# Altium schematic sheet ROARCAT.SchDoc: =DocumentName
size 420 x 297 mm; CompanyName: "AS Manufacturing" LLC; Organization: "AS Manufacturing" LLC; Address1: 5 Sklyarenka St.; Address2: Kyiv 04073; Address3: Ukraine; Address4: https://ajax.systems/en/; DocumentNumber: 2; SheetNumber: 2; SheetTotal: 6; Template_version: 1.0.1
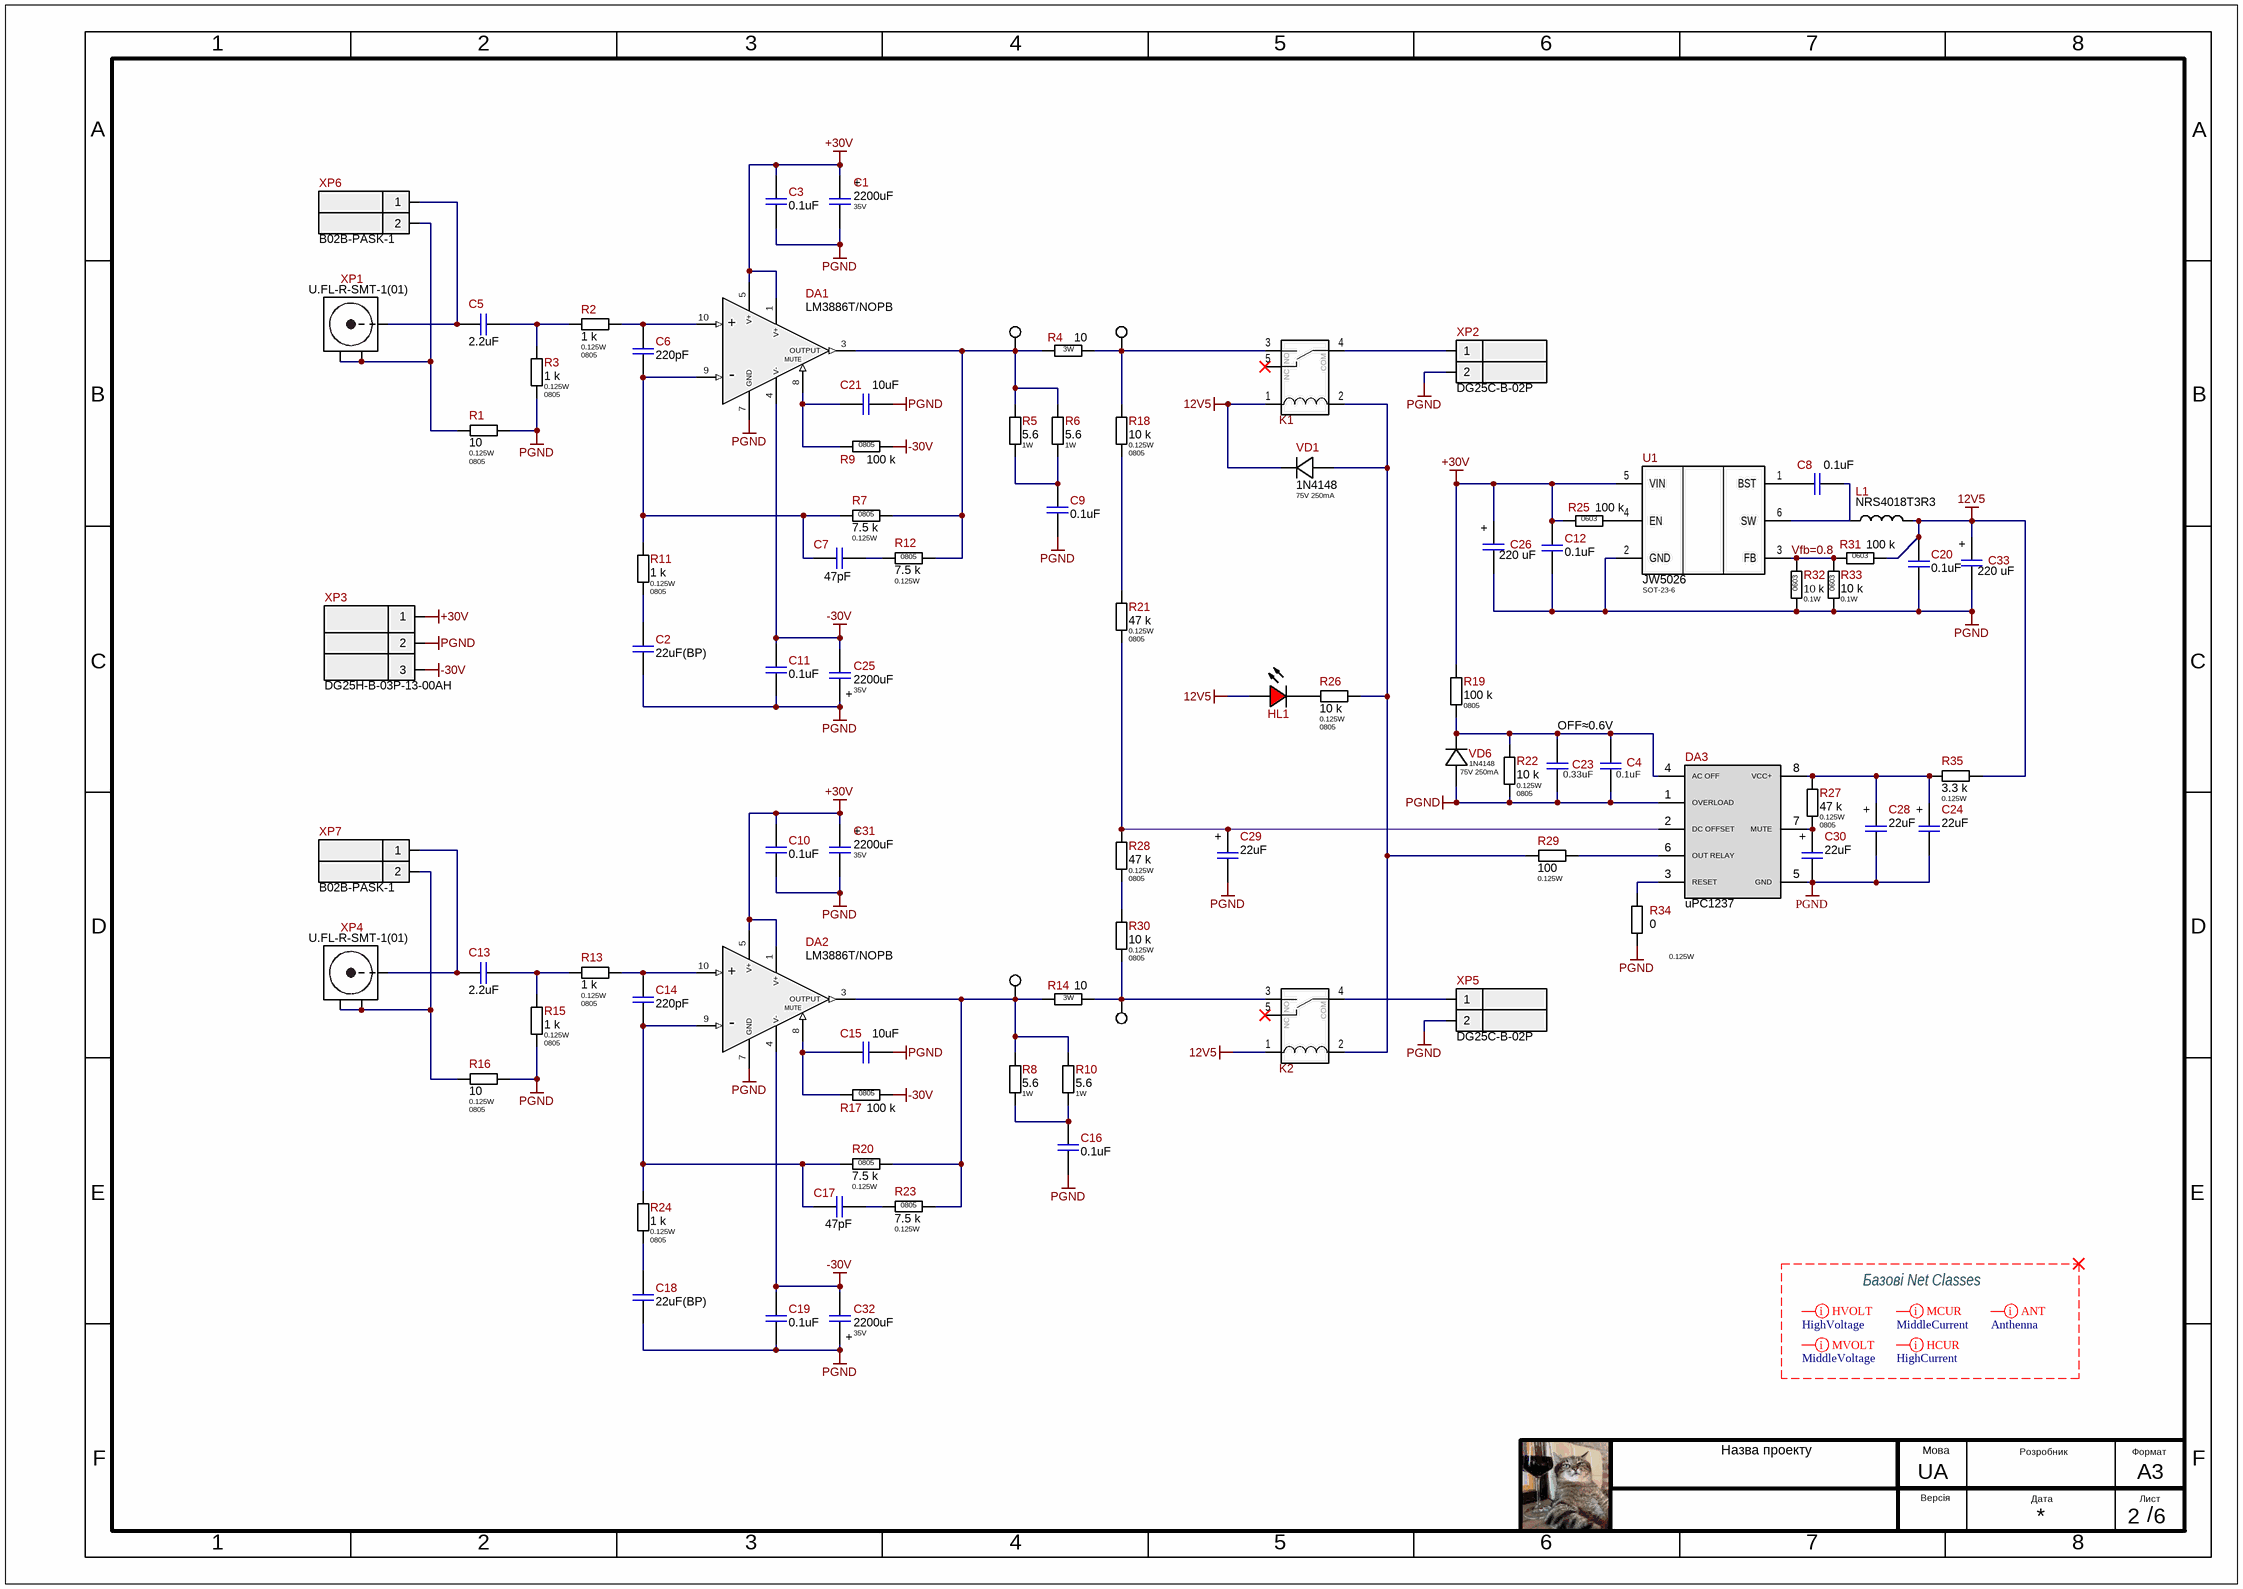
[diagram p0: ROARCAT.SchDoc]

## Parts
C1  2200uF  Power (V/A): 35V  [CAP16x31.5]
C2  22uF(BP)  [CAP-AE-PTH-80D05x115H15]
C3  0.1uF  [C0805(2012)]
C4  0.1uF  [C0805(2012)]
C5  2.2uF  [WIMA5]
C6  220pF  [C0603(1608)]
C7  47pF  [C0603(1608)]
C8  0.1uF  [C0603(1608)]
C9  0.1uF  [CAP 5MM]
C10  0.1uF  [C0805(2012)]
C11  0.1uF  [C0805(2012)]
C12  0.1uF  [C0603(1608)]
C13  2.2uF  [WIMA5]
C14  220pF  [C0603(1608)]
C15  10uF  [C1206(3216)]
C16  0.1uF  [CAP 5MM]
C17  47pF  [C0603(1608)]
C18  22uF(BP)  [CAP-AE-PTH-80D05x115H15]
C19  0.1uF  [C0805(2012)]
C20  0.1uF  [C0603(1608)]
C21  10uF  [C1206(3216)]
C23  0.33uF  [C0805(2012)]
C24  22uF  [CAP-AE-PTH-40D05x70H10]
C25  2200uF  Power (V/A): 35V  [CAP16x31.5]
C26  220 uF  [CAP 8x9]
C28  22uF  [CAP-AE-PTH-40D05x70H10]
C29  22uF  [CAP-AE-PTH-40D05x70H10]
C30  22uF  [CAP-AE-PTH-40D05x70H10]
C31  2200uF  Power (V/A): 35V  [CAP16x31.5]
C32  2200uF  Power (V/A): 35V  [CAP16x31.5]
C33  220 uF  [CAP 8x9]
DA1  LM3886T/NOPB  [TO-220-11]
DA2  LM3886T/NOPB  [TO-220-11]
DA3  uPC1237  [SIP-8]
HL1  FYLS-0603BURC  [LED-0603R]  (value not drawn)
K1  LEG-12  [Relay10A]  (value not drawn)
K2  LEG-12  [Relay10A]  (value not drawn)
L1  NRS4018T3R3  [WE-LQS SMD 4018]
R1  10  Power Rating: 0.125W  Package/Case: 0805  [R0805]
R2  1 k  Power Rating: 0.125W  Package/Case: 0805  [R0805]
R3  1 k  Power Rating: 0.125W  Package/Case: 0805  [R0805]
R4  10  Power Rating: 3W  [R3W]
R5  5.6  Power Rating: 1W  [R2512]
R6  5.6  Power Rating: 1W  [R2512]  (mechanical)
R7  7.5 k  Power Rating: 0.125W  Package/Case: 0805  [R0805]
R8  5.6  Power Rating: 1W  [R2512]
R9  100 k  Package/Case: 0805  [R0805]
R10  5.6  Power Rating: 1W  [R2512]  (mechanical)
R11  1 k  Power Rating: 0.125W  Package/Case: 0805  [R0805]
R12  7.5 k  Power Rating: 0.125W  Package/Case: 0805  [R0805]
R13  1 k  Power Rating: 0.125W  Package/Case: 0805  [R0805]
R14  10  Power Rating: 3W  [R3W]
R15  1 k  Power Rating: 0.125W  Package/Case: 0805  [R0805]
R16  10  Power Rating: 0.125W  Package/Case: 0805  [R0805]
R17  100 k  Package/Case: 0805  [R0805]
R18  10 k  Power Rating: 0.125W  Package/Case: 0805  [R0805]
R19  100 k  Package/Case: 0805  [R0805]
R20  7.5 k  Power Rating: 0.125W  Package/Case: 0805  [R0805]
R21  47 k  Power Rating: 0.125W  Package/Case: 0805  [R0805]
R22  10 k  Power Rating: 0.125W  Package/Case: 0805  [R0805]
R23  7.5 k  Power Rating: 0.125W  Package/Case: 0805  [R0805]
R24  1 k  Power Rating: 0.125W  Package/Case: 0805  [R0805]
R25  100 k  Package/Case: 0603  [R0603]
R26  10 k  Power Rating: 0.125W  Package/Case: 0805  [R0805]
R27  47 k  Power Rating: 0.125W  Package/Case: 0805  [R0805]
R28  47 k  Power Rating: 0.125W  Package/Case: 0805  [R0805]
R29  100  Power Rating: 0.125W  [R0805]
R30  10 k  Power Rating: 0.125W  Package/Case: 0805  [R0805]
R31  100 k  Package/Case: 0603  [R0603]
R32  10 k  Power Rating: 0.1W  Package/Case: 0603  [R0603]
R33  10 k  Power Rating: 0.1W  Package/Case: 0603  [R0603]  (mechanical)
R34  0  Power Rating: 0.125W  [R0805]
R35  3.3 k  Power Rating: 0.125W  [R0805]
TP1  PAD-1.75mm  [PAD-1.75mm]  (value not drawn)  (no BOM)
TP2  PAD-1.75mm  [PAD-1.75mm]  (value not drawn)  (no BOM)
TP3  PAD-1.75mm  [PAD-1.75mm]  (value not drawn)  (no BOM)
TP4  PAD-1.75mm  [PAD-1.75mm]  (value not drawn)  (no BOM)
U1  JW5026  Package: SOT-23-6  [SOT23-6]
VD1  1N4148  Power Rating: 75V 250mA  [SOD-80]
VD6  1N4148  Power Rating: 75V 250mA  [SOD-80]
XP1  U.FL-R-SMT-1(01)  [IPEX_ RECE.20279.001E.01]
XP2  DG25C-B-02P  [DG25C-B-02P]
XP3  DG25H-B-03P-13-00AH  [DG25H-B-03P]
XP4  U.FL-R-SMT-1(01)  [IPEX_ RECE.20279.001E.01]
XP5  DG25C-B-02P  [DG25C-B-02P]
XP6  B02B-PASK-1  [JST_B02B-PASK-1(LF)(SN)]
XP7  B02B-PASK-1  [JST_B02B-PASK-1(LF)(SN)]

## Nets
12V5: C20.2 C33.1 HL1.1(A) K1.1 K2.1 L1.2 R31.2 R35.1 VD1.1(K)
+30V: C1.1 C3.1 C10.1 C12.2 C26.1 C31.1 DA1.1(V+) DA1.5(V+) DA2.1(V+) DA2.5(V+) R19.2 R25.1 U1.5(VIN) XP3.1
-30V: C11.2 C19.2 C25.2 C32.2 DA1.4(V-) DA2.4(V-) R9.2 R17.2 XP3.3
PGND: C1.2 C2.1 C3.2 C4.1 C9.2 C10.2 C11.1 C12.1 C15.2 C16.2 C18.1 C19.1 C20.1 C21.2 C23.1 C24.2 C25.1 C26.2 C28.2 C29.2 C30.2 C31.2 C32.1 C33.2 DA1.7(GND) DA2.7(GND) DA3.1(OVERLOAD) DA3.5(GND) R1.2 R3.2 R15.2 R16.2 R22.1 R32.1 R33.1 R34.1 U1.2(GND) VD6.2(A) XP2.2 XP3.2 XP5.2
OFF≈0.6V: C4.2 C23.2 DA3.4(AC_OFF) R19.1 R22.2 VD6.1(K)
Vfb=0.8: R31.1 R32.2 R33.2 U1.3(FB)
NetC2_2: C2.2 R11.1
NetC5_1: C5.1 XP1.1 XP6.1
NetC5_2: C5.2 R2.2 R3.1
NetC6_1: C6.1 C7.1 DA1.9(VIN-) R7.1 R11.2
NetC6_2: C6.2 DA1.10(VIN+) R2.1
NetC7_2: C7.2 R12.1
NetC8_1: C8.1 U1.1(BST)
NetC8_2: C8.2 L1.1 U1.6(SW)
NetC9_1: C9.1 R5.1 R6.1
NetC13_1: C13.1 XP4.1 XP7.1
NetC13_2: C13.2 R13.2 R15.1
NetC14_1: C14.1 C17.1 DA2.9(VIN-) R20.1 R24.2
NetC14_2: C14.2 DA2.10(VIN+) R13.1
NetC15_1: C15.1 DA2.8(MUTE) R17.1
NetC16_1: C16.1 R8.1 R10.1
NetC17_2: C17.2 R23.1
NetC18_2: C18.2 R24.1
NetC21_1: C21.1 DA1.8(MUTE) R9.1
NetC24_1: C24.1 C28.1 DA3.8(VCC+) R27.2 R35.2
NetC29_1: C29.1 DA3.2(DC_OFFSET) R21.1 R28.2
NetC30_1: C30.1 DA3.7(MUTE) R27.1
NetDA1_3: DA1.3(OUTPUT) R4.1 R5.2 R6.2 R7.2 R12.2 TP2.1
NetDA2_3: DA2.3(OUTPUT) R8.2 R10.2 R14.1 R20.2 R23.2 TP3.1
NetDA3_3: DA3.3(RESET) R34.2
NetDA3_6: DA3.6(OUT_RELAY) R29.1
NetHL1_2: HL1.2(K) R26.2
NetK1_2: K1.2 K2.2 R26.1 R29.2 VD1.2(A)
NetK1_3: K1.3(NO) R4.2 R18.2 TP1.1
NetK1_4: K1.4(COM) XP2.1
NetK2_3: K2.3(NO) R14.2 R30.1 TP4.1
NetK2_4: K2.4(COM) XP5.1
NetR1_1: R1.1 XP1.2 XP1.3 XP6.2
NetR16_1: R16.1 XP4.2 XP4.3 XP7.2
NetR18_1: R18.1 R21.2
NetR25_2: R25.2 U1.4(EN)
NetR28_1: R28.1 R30.2

Not connected (* = marked no-connect by the designer): K1 5(NC)*; K2 5(NC)*

## Layout directives
net class HighVoltage: (no net found under the mark)
net class Anthenna: (no net found under the mark)
net class MiddleVoltage: (no net found under the mark)
net class MiddleCurrent: (no net found under the mark)
net class HighCurrent: (no net found under the mark)

## Notes on the sheet
- Базові Net Classes
- 1
- 2
- 3
- 4
- 5
- 6
- 7
- 8
- A
- B
- C
- D
- E
- F
- Назва проекту
- Мова
- UA
- Розробник
- Формат
- A3
- Версія
- Дата
- Лист
- /
- (in symbol 22uF  25V 4х6) +
- (in symbol 220 uF  16V 8 x 9) +
- (in symbol 2200uF  35V 16x31.5) +
- (in symbol LM3886T/NOPB) +; -

## Library data of the parts
C1 C25 C31 C32 = 2200uF  35V 16x31.5: 2200uF CAP ALUM 22UF 20% 35V RADIAL; Name Component: Electrolytic capacitor; Tolerance: ±10%; Operation Temperature: -55°C ~ 125°C; Library Path 1: Capacitors.SchLib; Part Number: 2200uF  35V 16x31.5; Value: 2200uF; Package/Case: 16x31.5; ComponentLink1Description: Datasheet
C2 C18 = 22uF(BP)  50V  8 x 11.5: ECEA1HN220U 22UF 20% 50V RADIAL; Manufacturer: Panasonic Electronic Components; Name Component: Bipolar Electrolytic Capacitor; Operation Temperature: -55°C ~ 105°C; Library Path 1: Capacitors.SchLib; Part Number: 22uF(BP)  50V  8 x 11.5; Value: 22uF(BP); Tolerance: ±20%; Temperature Coefficient: -; Power (V/A): 50V; Package/Case: 8 x 11.5; Manufacturer P/N: ECEA1HN220U; Supplier 1: kosmodrom; Supplier Part Number 1: P10340-ND; ComponentLink1Description: Datasheet
C3 C4 C10 C11 C19 = 0.1uF  50V C0805: CAP CER 0.1UF 50V X7R 0805; Manufacturer: AVX Corporation; Manufacturer P/N: 08055C104KAT2A; Name Component: Capacitor Ceramic; Tolerance: ±10%; Operation Temperature: -55°C ~ 105°C; Notes: 08055C104KAT4A,08055C104KAJ2A, 08055C104KAJ4A; Library Path 1: Capacitors.SchLib; Part Number: 0.1uF  50V C0805; Value: 0.1uF; Temperature Coefficient: X7R; Power (V/A): 50V; Package/Case: C0805; Supplier 1: Digi-key; Supplier Part Number 1: 478-1395-2-ND; ComponentLink1Description: Datasheet; ComponentLink1URL: http://catalogs.avx.com/SurfaceMount.pdf
C5 C13 = MKS2-2.2U/50-R: CAP FILM 2.2UF 10% 100VDC; Manufacturer: WIMA; Manufacturer P/N: MKS2B042201F00; Name Component: Polypropylene (PP), Metallized; Operation Temperature: -55°C ~ 125°C; Power (V/A): 63В AC, 100В DC; Library Path 1: Capacitors.SchLib; Part Number: MKS2-2.2U/50-R; Value: 2.2uF; Tolerance: ±10%; Package/Case: 5x10x7, 2мм; Supplier 1: kosmodrom; ComponentLink1Description: Datasheet; ComponentLink1URL: https://www.mouser.com/datasheet/2/440/e_WIMA_MKS_2-1139871.pdf?utm_source=chatgpt.com
C6 C14 = 220pF  25V C0603: CAP CER 220PF 25V X7R 0603; Manufacturer: AVX Corporation; Manufacturer P/N: 06033C221MAT2A; Tolerance: ±20%; Name Component: Capacitor Ceramic; Operation Temperature: -55°C ~ 105°C; Notes: 06033C221MAT4A; Library Path 1: Capacitors.SchLib; Part Number: 220pF  25V C0603; Value: 220pF; Supplier 1: Digi-key; Supplier Part Number 1: 06033C221MAT2A-ND; ComponentLink1Description: Datasheet; ComponentLink1URL: http://catalogs.avx.com/SurfaceMount.pdf; Temperature Coefficient: X7R; Power (V/A): 25V; Package/Case: C0603
C7 C17 = 47pF  50V C0603: CAP CER 47PF 50V X7R 0603; Manufacturer: AVX Corporation; Manufacturer P/N: 06035C470KAT2A; Tolerance: ±10%; Name Component: Capacitor Ceramic; Operation Temperature: -55°C ~ 105°C; Library Path 1: Capacitors.SchLib; Part Number: 47pF  50V C0603; Value: 47pF; Supplier 1: Digi-key; Supplier Part Number 1: 06035C470KAT2A-ND; ComponentLink1Description: Datasheet; ComponentLink1URL: http://catalogs.avx.com/SurfaceMount.pdf; Temperature Coefficient: X7R; Power (V/A): 50V; Package/Case: C0603
C8 C12 C20 = 0.1uF  50V C0603: CAP CER 0.1UF 50V X7R 0603; Manufacturer: Samsung Electro-Mechanics; Manufacturer P/N: CL10B104KB8WPNC; Name Component: Capacitor Ceramic; Tolerance: ±10%; Operation Temperature: -55°C ~ 125°C; Notes: 06035C104K4T4A, 06035C104K4T2A; Library Path 1: Capacitors.SchLib; Part Number: 0.1uF  50V C0603; Value: 0.1uF; Temperature Coefficient: X7R; Power (V/A): 50V; Package/Case: C0603; Supplier 1: Digi-key; Supplier Part Number 1: 1276-6854-2-ND; ComponentLink1Description: Datasheet; ComponentLink1URL: https://www.samsungsem.com/resources/file/global/support/product_catalog/MLCC.pdf
C9 C16 = 0.1uF  50V C0805: CAP CER 0.1UF 50V X7R 0805; Manufacturer: AVX Corporation; Manufacturer P/N: 08055C104KAT2A; Tolerance: ±10%; Name Component: Capacitor Ceramic; Operation Temperature: -55°C ~ 105°C; Notes: 08055C104KAT4A,08055C104KAJ2A, 08055C104KAJ4A; Library Path 1: Capacitors.SchLib; Part Number: 0.1uF  50V C0805; Value: 0.1uF; Supplier 1: Digi-key; Supplier Part Number 1: 478-1395-2-ND; ComponentLink1Description: Datasheet; ComponentLink1URL: http://catalogs.avx.com/SurfaceMount.pdf; Temperature Coefficient: X7R; Power (V/A): 50V; Package/Case: C0805
C15 C21 = 10uF  35V С1206: CAP CER 10UF 35V X5R 1206; Manufacturer: AVX Corporation; Manufacturer P/N: 1206DD106KAT2A; Name Component: Capacitor Ceramic; Tolerance: ±10%; Operation Temperature: -55°C ~ 105°C; Library Path 1: Capacitors.SchLib; Part Number: 10uF  35V С1206; Value: 10uF; Temperature Coefficient: X5R; Power (V/A): 35V; Package/Case: С1206; Supplier 1: Digi-key; Supplier Part Number 1: 478-9953-2-ND; ComponentLink1Description: Datasheet; ComponentLink1URL: http://catalogs.avx.com/SurfaceMount.pdf
C23 = 0.33uF  25V C0805: CAP CER 0.33UF 25V X7R 0805; Manufacturer: AVX Corporation; Manufacturer P/N: 08053C334MAT2A; Tolerance: ±20%; Name Component: Capacitor Ceramic; Operation Temperature: -55°C ~ 105°C; Library Path 1: Capacitors.SchLib; Part Number: 0.33uF  25V C0805; Value: 0.33uF; Supplier 1: Digi-key; Supplier Part Number 1: 478-5720-2-ND; ComponentLink1Description: Datasheet; ComponentLink1URL: http://catalogs.avx.com/SurfaceMount.pdf; Temperature Coefficient: X7R; Power (V/A): 25V; Package/Case: C0805
C24 C28-C30 = 22uF  25V 4х6: CAP ALUM 22UF 20% 25V RADIAL; Name Component: Electrolytic capacitor; Tolerance: ±10%; Operation Temperature: -55°C ~ 125°C; Library Path 1: Capacitors.SchLib; Part Number: 22uF  25V 4х6; Value: 22uF; Power (V/A): 25V; Package/Case: 4х6; ComponentLink1Description: Datasheet
C26 C33 = 220 uF  16V 8 x 9: CAP POLY 220 UF 20% 16V 8x9; Manufacturer: Leaguer; Manufacturer P/N: VPT1C221M0809; Name Component: Conductive Polymer Aluminum Solid Capacitors; Operation Temperature: -55°C ~ 105°C; Library Path 1: Capacitors.SchLib; Part Number: 220 uF  16V 8 x 9; Value: 220 uF; Tolerance: ±20%; Temperature Coefficient: -; Power (V/A): 16V; Package/Case: 8 x 9; Supplier 1: RCS; Supplier Part Number 1: 124733; ComponentLink1Description: Datasheet; ComponentLink1URL: https://www.rcscomponents.kiev.ua/datasheets/kks4700608x9-datasheet.pdf
DA1 DA2 = LM3886T/NOPB: IC AMP CLSS AB MONO 68W TO220-11; Manufacturer: Texas Instruments; Name Component: Amplifier; Operation Temperature: -20°C ~ 85°C (TA); Power (V/A): 20V ~ 84V, ±10V ~ 42V; Library Path 1: Integrated Circuit.SchLib; Part Number: LM3886T/NOPB; Value: LM3886T/NOPB; Package/Case: TO-220-11; Manufacturer P/N: LM3886T/NOPB; Supplier 1: Digi-key; Supplier Part Number 1: LM3886T/NOPB-ND; ComponentLink1Description: Datasheet; ComponentLink1URL: https://www.ti.com/general/docs/suppproductinfo.tsp?distId=10&gotoUrl=https%3A%2F%2Fwww.ti.com%2Flit%2Fgpn%2Flm3886
DA3 = uPC1237: Protector IC for Stereo Power Amplifier & Loudspeaker, 25-60V, -20-75°C; Manufacturer: NEC; Name Component: Audio Protect; Operation Temperature: -20°C ~ 75°C; Power (V/A): 12-15V; Library Path 1: Integrated Circuit.SchLib; Part Number: uPC1237; Value: uPC1237; Package/Case: SIP-8; ComponentLink1Description: Datasheet; ComponentLink1URL: https://www.rcscomponents.kiev.ua/datasheets/datasheet_upc1237.pdf
HL1 = FYLS-0603BURC: LED RED LED0603; Manufacturer: FORYARD; Name Component: LED Lighting; Operation Temperature: -40 ~ +85; Power (V/A): 20mA; Library Path 1: Optoelectronic.SchLib; Part Number: FYLS-0603BURC; Value: FYLS-0603BURC; Package/Case: 0603; Manufacturer P/N: FYLS-0603BURC; Notes: Red; ComponentLink1Description: Datasheet; ComponentLink1URL: http://www.foryard-led.ru/pdf/fyls-0603burc.pdf
K1 K2 = LEG-12: General Purpose Relay, 1 Form C (1PDT), 12VDC 400Ohm Coil, 120VAC/24VDC @ 10A, 240VAC Max; Operation Temperature: -55°C ~ 125°C (TA); Power (V/A): 12V; Library Path 1: Others.SchLib; ComponentLink1URL: https://www.tme.eu/Document/311affc211749c2a4c93ad074af62b72/LEG-SERIES.pdf; ComponentLink1Description: Datasheet; Part Number: LEG-12; Name Component: Relay; Value: LEG-12; Supplier Part Number 1: Relay10A
L1 = NRS4018T3R3: FIXED IND 3.3UH 2A 66 MOHM SMD; Manufacturer: TaiyoYuden; Manufacturer P/N: NRS4018T3R3MDGJ; Name Component: Fixed Inductors; Tolerance: ±20; Operation Temperature: -25°C ~ 120°C; Library Path 1: Inductance.SchLib; Part Number: NRS4018T3R3; Value: NRS4018T3R3; Power (V/A): 2A; Package/Case: 4.00mm x 4.00mm; Supplier 1: Digi-key; Supplier Part Number 1: 587-2892-2-ND; ComponentLink1Description: Datasheet; ComponentLink1URL: https://www.yuden.co.jp/productdata/catalog/wound04_e.pdf
R1 R16 = 10  R0805: RES SMD 10 OHM  ±1% 1/8W 0805; Name Component: Resistror; Operation Temperature: -55℃ to 155℃; Temperature Coefficient: ±200 ppm/°C; Library Path 1: Resistor.SchLib; Part Number: 10  R0805; Value: 10; Tolerance: ±1%
R2 R3 R11 R13 R15 R24 = 1 k  R0805: RES SMD 1 k OHM  ±1% 1/8W 0805; Name Component: Resistror; Operation Temperature: -55℃ to 155℃; Temperature Coefficient: ±100 ppm/°C; Library Path 1: Resistor.SchLib; Part Number: 1 k  R0805; Value: 1 k; Tolerance: ±1%
R4 R14 = 10  RES_3W: Resistror 10 OHM  ±5% AXIAL  5.50mm x 15.00mm; Operation Temperature: -55℃ to 155℃; Temperature Coefficient: ±200 ppm/°C; Library Path 1: Resistor.SchLib; Part Number: 10  RES_3W; Name Component: Resistror; Value: 10; Tolerance: ±5%
R5 R6 R8 R10 = 5.6  R2512: Resistror 5.6 OHM  ±5% 2512 1W; Operation Temperature: -55℃ to 155℃; Temperature Coefficient: ±200 ppm/°C; Library Path 1: Resistor.SchLib; Part Number: 5.6  R2512; Name Component: Resistror; Value: 5.6; Tolerance: ±5%
R7 R12 R20 R23 = 7.5 k  R0805: RES SMD 7.5 k OHM  ±1% 1/8W 0805; Name Component: Resistror; Operation Temperature: -55℃ to 155℃; Temperature Coefficient: ±100 ppm/°C; Library Path 1: Resistor.SchLib; Part Number: 7.5 k  R0805; Value: 7.5 k; Tolerance: ±1%
R9 R17 = 10 k  R0805: RES SMD 10 k OHM  ±1% 1/8W 0805; Power Rating: 0.125W; Name Component: Resistror; Operation Temperature: -55℃ to 155℃; Temperature Coefficient: ±100 ppm/°C; Library Path 1: Resistor.SchLib; Part Number: 10 k  R0805; Value: 100 k; Tolerance: ±1%
R18 R22 R26 R30 = 10 k  R0805: RES SMD 10 k OHM  ±1% 1/8W 0805; Name Component: Resistror; Operation Temperature: -55℃ to 155℃; Temperature Coefficient: ±100 ppm/°C; Library Path 1: Resistor.SchLib; Part Number: 10 k  R0805; Value: 10 k; Tolerance: ±1%
R19 = 100 k  R0805: RES SMD 100 k OHM  ±1% 1/8W 0805; Power Rating: 0.125W; Name Component: Resistror; Operation Temperature: -55℃ to 155℃; Temperature Coefficient: ±100 ppm/°C; Library Path 1: Resistor.SchLib; Part Number: 100 k  R0805; Value: 100 k; Tolerance: ±1%
R21 R27 R28 = 47 k  R0805: RES SMD 47 k OHM  ±1% 1/8W 0805; Name Component: Resistror; Operation Temperature: -55℃ to 155℃; Temperature Coefficient: ±100 ppm/°C; Library Path 1: Resistor.SchLib; Part Number: 47 k  R0805; Value: 47 k; Tolerance: ±1%
R25 R31 = 100 k  R0603: RES SMD 100 k OHM  ±1% 1/10W 0603; Power Rating: 0.1W; Name Component: Resistror; Operation Temperature: -55℃ to 155℃; Temperature Coefficient: ±100 ppm/°C; Library Path 1: Resistor.SchLib; Part Number: 100 k  R0603; Value: 100 k; Tolerance: ±1%
R29 = 100  R0805: RES SMD 100 OHM  ±1% 1/8W 0805; Name Component: Resistror; Operation Temperature: -55℃ to 155℃; Temperature Coefficient: ±100 ppm/°C; Library Path 1: Resistor.SchLib; Package/Case: 0805; Part Number: 100  R0805; Value: 100; Tolerance: ±1%
R32 R33 = 10 k  R0603: RES SMD 10 k OHM  ±1% 1/10W 0603; Name Component: Resistror; Operation Temperature: -55℃ to 155℃; Temperature Coefficient: ±100 ppm/°C; Library Path 1: Resistor.SchLib; Part Number: 10 k  R0603; Value: 10 k; Tolerance: ±1%
R34 = 0  R0805: RES SMD 0 OHM  ±1% 1/8W 0805; Part Number: 0  R0805; Name Component: Resistror; Operation Temperature: -55℃ to 155℃; Temperature Coefficient: ±200 ppm/°C; Library Path 1: Resistor.SchLib; Value: 0; Tolerance: ±1%; Package/Case: 0805
R35 = 3.3 k  R0805: RES SMD 3.3 k OHM  ±1% 1/8W 0805; Name Component: Resistror; Operation Temperature: -55℃ to 155℃; Temperature Coefficient: ±100 ppm/°C; Library Path 1: Resistor.SchLib; Part Number: 3.3 k  R0805; Value: 3.3 k; Tolerance: ±1%; Package/Case: 0805
TP1-TP4 = PAD-1.75mm: 1.75mm Pad for Plug-In or Receptacle; Ajax_1C_PN: NONE; Ajax_1С_Status: RND Only; Component Status: Released; Part Number: PAD-1.75mm; Component Type: PTH; Manufacturer: NONE; Part Type: Pad; Temperature Range: NONE; ComponentLink1URL: NONE; Replacement: NONE; Price: NONE; ComponentLink1Description: Datasheet
U1 = JW5026: Switching Voltage Regulators 4.7V to 40V Input, 1A Output , Vfb = 0.6V VStep-Down Converter SOT-23-6; Manufacturer: Joulwatt Technology; Name Component: Power converters; Operation Temperature: -40°C ~ 125°C (TJ); Power (V/A): 4.7…40V 2A; Library Path 1: Power converters.SchLib; ComponentDescription: Power converters JW5026  (SOT 23-6); ComponentLink1URL: https://www.skytech.ir/DownLoad/File/2588_JW5026.pdf; ComponentLink1Description: Datasheet; Part Number: JW5026; Value: JW5026; Package/Case: SOT 23-6; Supplier 1: Kosmodrom; Supplier Part Number 1: JW5026
VD1 VD6 = 1N4148: DIODE GEN PURP 75V 250MA SOD323; Manufacturer: Diodes Incorporated; Operation Temperature: -55°C ~ 150°C; Library Path 1: Diodes.SchLib; Part Number: 1N4148; Name Component: Diode; Value: 1N4148; Package/Case: SOD-80; Manufacturer P/N: 1N4148; Supplier 1: Digi-key; Supplier Part Number 1: 1N4148; ComponentLink1Description: Datasheet
XP1 XP4 = U.FL-R-SMT-1(01): CONN UMC RCPT STR 50 OHM SMD; Manufacturer: HIROSE; Name Component: U.FL (IPX/AMC); Operation Temperature: -10°C …. 40°C; Library Path 1: Connectors.SchLib; System: Connector; Part Number: U.FL-R-SMT-1(01); Value: U.FL-R-SMT-1(01); Package/Case: Male Pin; Manufacturer P/N: U.FL-R-SMT-1(01); Supplier 1: TME; ComponentLink1Description: Datasheet; ComponentLink1URL: https://www.tme.eu/ua/ru/details/u.fl-r-smt-1-01/mikrorazemy/hirose/u-fl-r-smt-1-01/
XP2 XP5 = DG25C-B-02P: CONN TERMINAL BLOCKS 7.62MM; Manufacturer: DEGSON; Manufacturer P/N: DG25C-B-02P-13-00AH; Operation Temperature: -40°C ~ 105°C; Power (V/A): 15A  2000V; Library Path 1: Connectors.SchLib; Part Number: DG25C-B-02P; Name Component: Terminal Blocks; Value: DG25C-B-02P; Package/Case: 7.62 mm; Supplier 1: Kosmodrom; ComponentLink1Description: Datasheet; ComponentLink1URL: http://www.kosmodrom.com.ua/pdf/DG25C-B.pdf
XP3 = DG25H-B-03P-13-00AH: 3PIN 7.62mm 300V 15 A  7-30 AWG; Name Component: Power Connectors; Operation Temperature: -65°C ~ 125°C; Library Path 1: Connectors.SchLib; System: Connector; Part Number: DG25H-B-03P-13-00AH; Value: DG25H-B-03P-13-00AH; Power (V/A): 300V 15 A; Package/Case: 7,62 mm; Supplier 1: RCS; ComponentLink1Description: Datasheet; ComponentLink1URL: https://www.rcscomponents.kiev.ua/datasheets/DG25H-B-XXP-1Y-00A%28H%29.Jpg
XP6 XP7 = B02B-PASK-1: CONN HEADER VERT 2POS 2MM; Manufacturer: JST Sales America Inc.; Manufacturer P/N: B02B-PASK-1(LF)(SN); Name Component: Rectangular Connectors - Headers; Operation Temperature: -55 °C to +105 °C; Power (V/A): 3A; Library Path 1: Connectors.SchLib; Part Number: B02B-PASK-1; Value: B02B-PASK-1; Package/Case: 2mm; Supplier 1: Digi-key; ComponentLink1Description: Datasheet; ComponentLink1URL: http://www.jst-mfg.com/product/pdf/eng/ePA-F.pdf